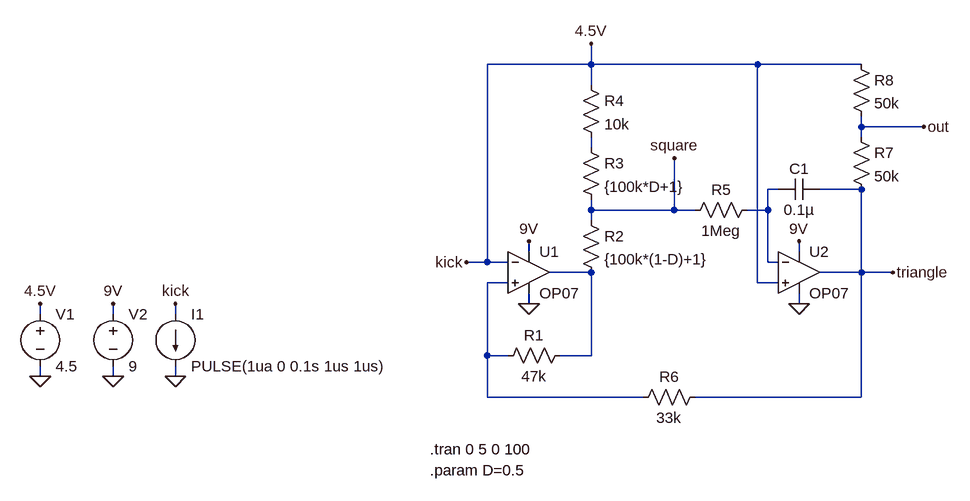
[diagram p0: schematic Boss CE-2 LFO.asc]
Boss CE-2 LFO.asc, the LTspice schematic file:
Version 4
SHEET 1 1132 680
WIRE 560 -288 560 -320
WIRE 560 -288 400 -288
WIRE 816 -288 560 -288
WIRE 976 -288 816 -288
WIRE 560 -256 560 -288
WIRE 976 -192 976 -208
WIRE 1072 -192 976 -192
WIRE 976 -176 976 -192
WIRE 560 -160 560 -176
WIRE 848 -96 832 -96
WIRE 976 -96 912 -96
WIRE 560 -64 560 -80
WIRE 688 -64 688 -144
WIRE 688 -64 560 -64
WIRE 720 -64 688 -64
WIRE 832 -64 832 -96
WIRE 832 -64 800 -64
WIRE 560 -48 560 -64
WIRE 464 0 464 -16
WIRE 880 0 880 -16
WIRE 400 16 400 -288
WIRE 400 16 368 16
WIRE 432 16 400 16
WIRE 832 16 832 -64
WIRE 848 16 832 16
WIRE 560 32 496 32
WIRE 976 32 976 -96
WIRE 976 32 912 32
WIRE 1024 32 976 32
WIRE 432 48 400 48
WIRE 816 48 816 -288
WIRE 848 48 816 48
WIRE 464 80 464 64
WIRE 880 80 880 64
WIRE -288 96 -288 80
WIRE -176 96 -176 80
WIRE -80 96 -80 80
WIRE 400 160 400 48
WIRE 432 160 400 160
WIRE 560 160 560 32
WIRE 560 160 512 160
WIRE -288 192 -288 176
WIRE -176 192 -176 176
WIRE -80 192 -80 176
WIRE 400 224 400 160
WIRE 640 224 400 224
WIRE 976 224 976 32
WIRE 976 224 720 224
FLAG -288 192 0
FLAG -288 80 4.5V
FLAG -176 192 0
FLAG -176 80 9V
FLAG 464 -16 9V
FLAG 880 -16 9V
FLAG 464 80 0
FLAG 880 80 0
FLAG 560 -320 4.5V
FLAG 1072 -192 out
FLAG -80 192 0
FLAG -80 80 kick
FLAG 368 16 kick
FLAG 688 -144 square
FLAG 1024 32 triangle
SYMBOL voltage -288 80 R0
SYMATTR InstName V1
SYMATTR Value 4.5
SYMBOL OpAmps\\OP07 464 -32 R0
SYMATTR InstName U1
SYMBOL OpAmps\\OP07 880 -32 R0
SYMATTR InstName U2
SYMBOL voltage -176 80 R0
SYMATTR InstName V2
SYMATTR Value 9
SYMBOL res 528 144 R90
WINDOW 0 0 56 VBottom 2
WINDOW 3 32 56 VTop 2
SYMATTR InstName R1
SYMATTR Value 47k
SYMBOL res 544 -64 R0
SYMATTR InstName R2
SYMATTR Value {100k*(1-D)+1}
SYMBOL res 544 -176 R0
SYMATTR InstName R3
SYMATTR Value {100k*D+1}
SYMBOL res 544 -272 R0
SYMATTR InstName R4
SYMATTR Value 10k
SYMBOL res 816 -80 R90
WINDOW 0 0 56 VBottom 2
WINDOW 3 32 56 VTop 2
SYMATTR InstName R5
SYMATTR Value 1Meg
SYMBOL cap 912 -112 R90
WINDOW 0 0 32 VBottom 2
WINDOW 3 32 32 VTop 2
SYMATTR InstName C1
SYMATTR Value 0.1µ
SYMBOL res 736 208 R90
WINDOW 0 0 56 VBottom 2
WINDOW 3 32 56 VTop 2
SYMATTR InstName R6
SYMATTR Value 33k
SYMBOL res 960 -192 R0
SYMATTR InstName R7
SYMATTR Value 50k
SYMBOL res 960 -304 R0
SYMATTR InstName R8
SYMATTR Value 50k
SYMBOL current -80 96 R0
SYMATTR InstName I1
SYMATTR Value PULSE(1ua 0 0.1s 1us 1us)
TEXT 312 304 Left 2 !.tran 0 5 0 100
TEXT 312 336 Left 2 !.param D=0.5

The netlist it stands for:
* Boss CE-2 LFO.asc
V1 kick 0 4.5
XU1 N004 kick 9V 0 N003 LT1001  ; OP07, pins In+ In- V+ V- OUT
XU2 kick N002 9V 0 triangle LT1001  ; OP07, pins In+ In- V+ V- OUT
V2 9V 0 9
R1 N003 N004 47k
R2 square N003 {100k*(1-D)+1}
R3 N001 square {100k*D+1}
R4 kick N001 10k
R5 N002 square 1Meg
C1 triangle N002 0.1µ
R6 triangle N004 33k
R7 out triangle 50k
R8 kick out 50k
I1 kick 0 PULSE(1ua 0 0.1s 1us 1us)
.tran 0 5 0 100
.param D=0.5
.lib LTC.lib
.backanno
.end